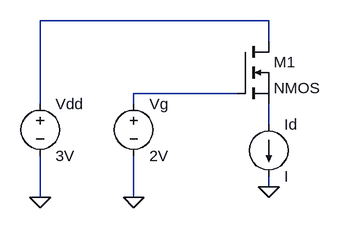
[diagram p0: schematic Draft1.asc]
Draft1.asc, the LTspice schematic file:
Version 4.1
SHEET 1 880 680
WIRE 256 0 -96 0
WIRE 256 32 256 0
WIRE 208 112 48 112
WIRE -96 128 -96 0
WIRE 48 128 48 112
WIRE 256 160 256 128
WIRE 256 256 256 240
WIRE -96 272 -96 208
WIRE 48 272 48 208
FLAG 256 256 0
FLAG -96 272 0
FLAG 48 272 0
SYMBOL voltage 48 112 R0
WINDOW 123 0 0 Left 0
WINDOW 39 0 0 Left 0
SYMATTR InstName Vg
SYMATTR Value 2V
SYMBOL voltage -96 112 R0
WINDOW 123 0 0 Left 0
WINDOW 39 0 0 Left 0
SYMATTR InstName Vdd
SYMATTR Value 3V
SYMBOL nmos 208 32 R0
SYMATTR InstName M1
SYMBOL current 256 160 R0
SYMATTR InstName Id

The netlist it stands for:
* Draft1.asc
Vg N002 0 2V
Vdd N001 0 3V
M1 N001 N002 N003 N003 NMOS
Id N003 0 I
.model NMOS NMOS
.model PMOS PMOS
.lib standard.mos
.backanno
.end